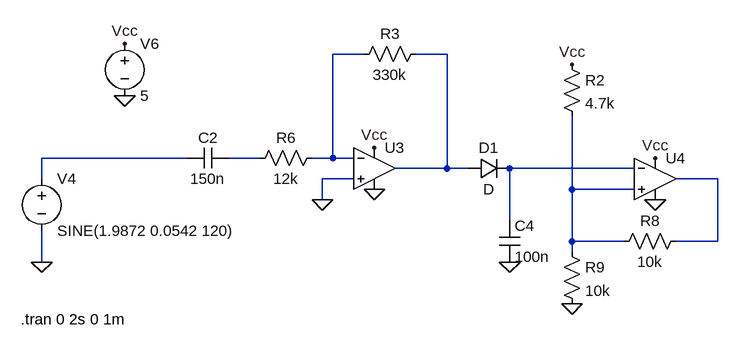
[diagram p0: schematic LTspice simulation.asc]
LTspice simulation.asc, the LTspice schematic file:
Version 4
SHEET 1 1300 680
WIRE 96 -672 48 -672
WIRE 224 -672 176 -672
WIRE -176 -512 -400 -512
WIRE -64 -512 -112 -512
WIRE 48 -512 48 -672
WIRE 48 -512 16 -512
WIRE 80 -512 48 -512
WIRE 224 -496 224 -672
WIRE 224 -496 144 -496
WIRE 256 -496 224 -496
WIRE 512 -496 320 -496
WIRE -400 -480 -400 -512
WIRE 80 -480 32 -480
WIRE 640 -480 576 -480
WIRE 416 -464 416 -576
WIRE 512 -464 416 -464
WIRE 32 -448 32 -480
WIRE 320 -416 320 -496
WIRE 416 -384 416 -464
WIRE 496 -384 416 -384
WIRE 640 -384 640 -480
WIRE 640 -384 576 -384
WIRE 416 -368 416 -384
WIRE -400 -352 -400 -400
FLAG 112 -464 0
FLAG 32 -448 0
FLAG 320 -352 0
FLAG -272 -688 Vcc
FLAG -272 -608 0
FLAG 544 -448 0
FLAG 544 -512 Vcc
FLAG 416 -288 0
FLAG 416 -656 Vcc
FLAG -400 -352 0
FLAG 112 -528 Vcc
SYMBOL cap -112 -528 R90
WINDOW 0 0 32 VBottom 2
WINDOW 3 32 32 VTop 2
SYMATTR InstName C2
SYMATTR Value 150n
SYMBOL voltage -400 -496 R0
WINDOW 123 0 0 Left 2
WINDOW 39 0 0 Left 2
SYMATTR InstName V4
SYMATTR Value SINE(1.9872 0.0542 120)
SYMBOL res 32 -528 R90
WINDOW 0 0 56 VBottom 2
WINDOW 3 32 56 VTop 2
SYMATTR InstName R6
SYMATTR Value 12k
SYMBOL Opamps\\UniversalOpamp2 112 -496 R0
SYMATTR InstName U3
SYMBOL cap 304 -416 R0
SYMATTR InstName C4
SYMATTR Value 100n
SYMBOL voltage -272 -704 R0
WINDOW 123 0 0 Left 2
WINDOW 39 0 0 Left 2
SYMATTR InstName V6
SYMATTR Value 5
SYMBOL res 592 -400 R90
WINDOW 0 0 56 VBottom 2
WINDOW 3 32 56 VTop 2
SYMATTR InstName R8
SYMATTR Value 10k
SYMBOL res 400 -384 R0
SYMATTR InstName R9
SYMATTR Value 10k
SYMBOL Opamps\\UniversalOpamp2 544 -480 R0
SYMATTR InstName U4
SYMBOL res 400 -672 R0
SYMATTR InstName R2
SYMATTR Value 4.7k
SYMBOL diode 256 -480 R270
WINDOW 0 32 32 VTop 2
WINDOW 3 0 32 VBottom 2
SYMATTR InstName D1
SYMBOL res 192 -688 R90
WINDOW 0 0 56 VBottom 2
WINDOW 3 32 56 VTop 2
SYMATTR InstName R3
SYMATTR Value 330k
TEXT -432 -264 Left 2 !.tran 0 2s 0 1m

The netlist it stands for:
* LTspice simulation.asc
C2 N004 N003 150n
V4 N003 0 SINE(1.9872 0.0542 120)
R6 N001 N004 12k
XU3 0 N001 Vcc 0 N002 level.2 Avol=1Meg GBW=10Meg Slew=10Meg ilimit=25m rail=0 Vos=0 phimargin=45 en=0 enk=0 in=0 ink=0 Rin=500Meg  ; pins IN+ IN- V+ V- OUT
C4 N005 0 100n
V6 Vcc 0 5
R8 N006 N007 10k
R9 N007 0 10k
XU4 N007 N005 Vcc 0 N006 level.2 Avol=1Meg GBW=10Meg Slew=10Meg ilimit=25m rail=0 Vos=0 phimargin=45 en=0 enk=0 in=0 ink=0 Rin=500Meg  ; pins IN+ IN- V+ V- OUT
R2 Vcc N007 4.7k
D1 N002 N005 D
R3 N002 N001 330k
.model D D
.lib standard.dio
.tran 0 2s 0 1m
.lib UniversalOpamps2.sub
.backanno
.end